# EAGLE design leak (EAGLE 9.6.0)
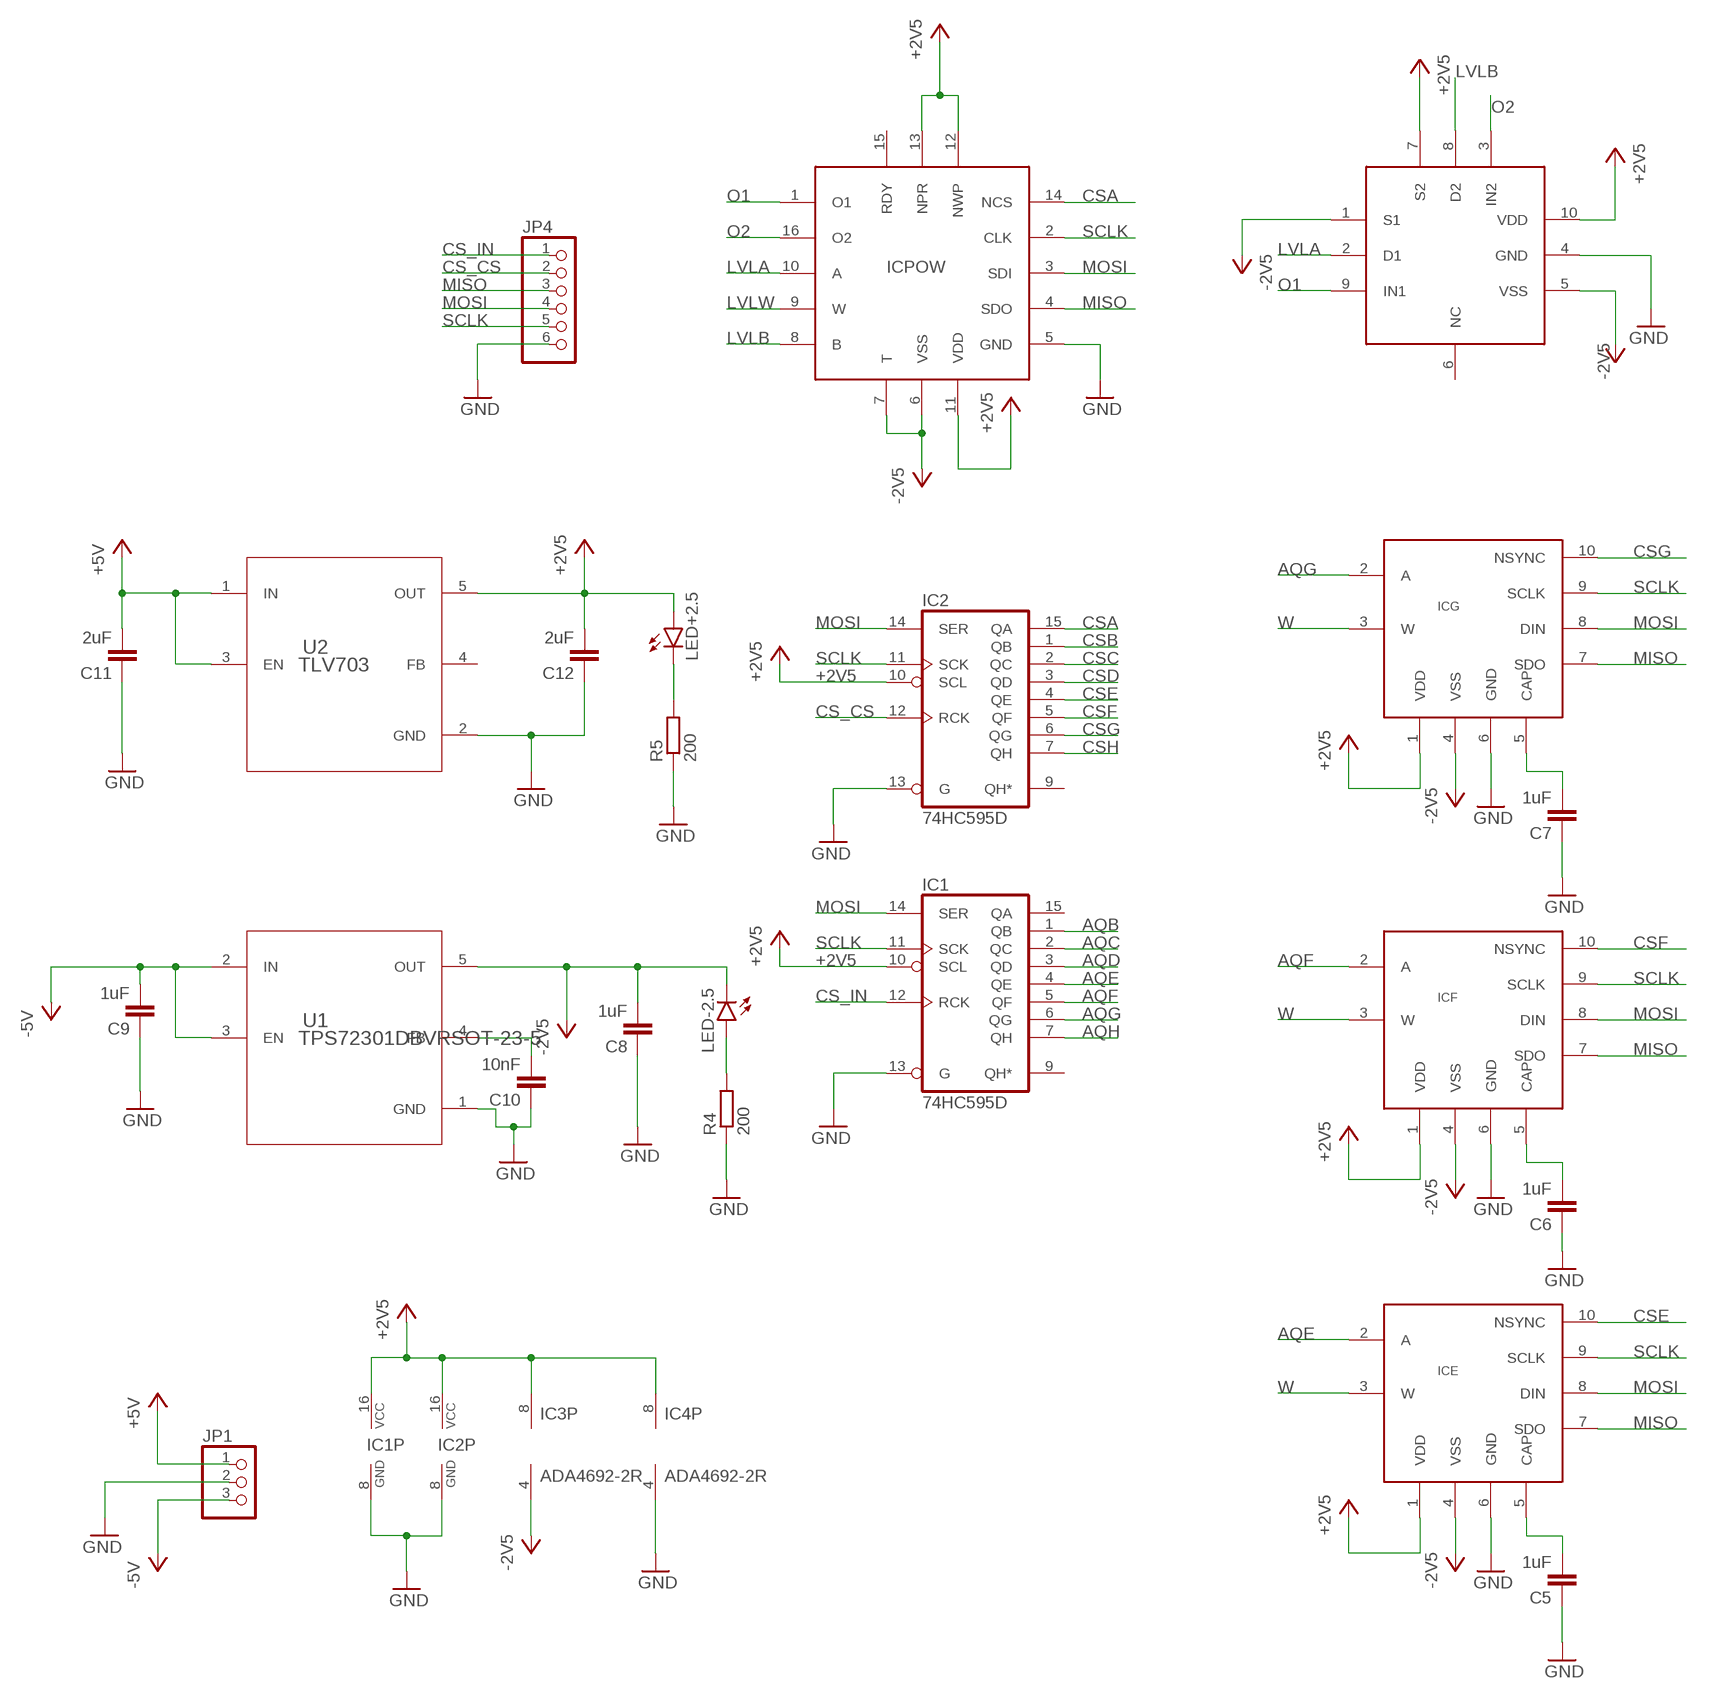
[diagram p0: schematic, sheet 1, part 1 of 2]
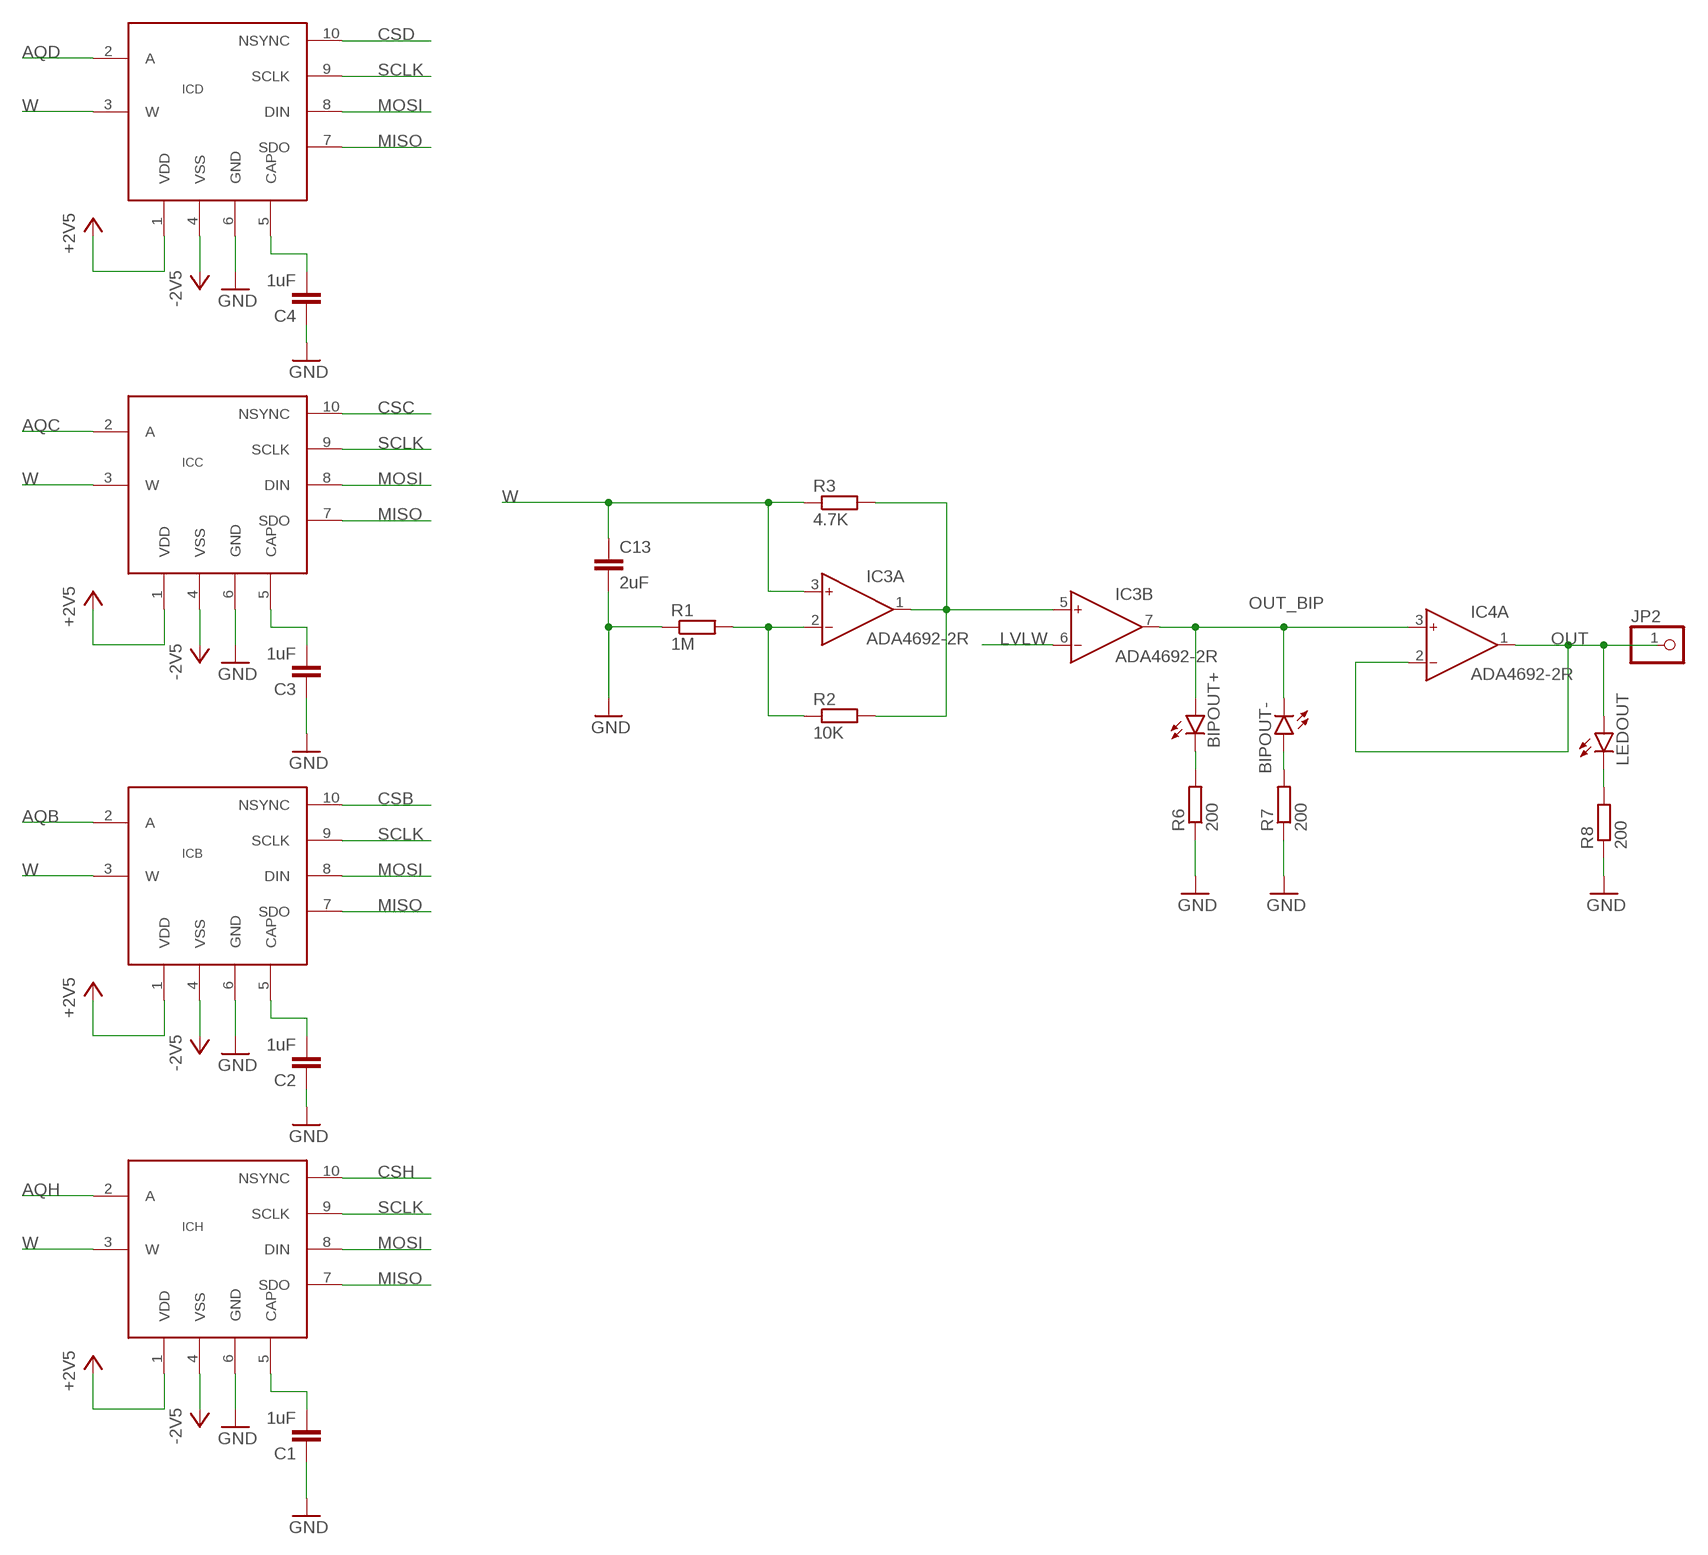
[diagram p1: schematic, sheet 1, part 2 of 2]

## Parts
BIPOUT+  LEDCHIPLED_0805  [CHIPLED_0805]
BIPOUT-  LEDCHIPLED_0805  [CHIPLED_0805]
C1  1uF  C-EUC0603  [C0603]
C2  1uF  C-EUC0603  [C0603]
C3  1uF  C-EUC0603  [C0603]
C4  1uF  C-EUC0603  [C0603]
C5  1uF  C-EUC0603  [C0603]
C6  1uF  C-EUC0603  [C0603]
C7  1uF  C-EUC0603  [C0603]
C8  1uF  C-EUC0603  [C0603]
C9  1uF  C-EUC0603  [C0603]
C10  10nF  C-EUC0603  [C0603]
C11  2uF  C-EUC0603  [C0603]
C12  2uF  C-EUC0603  [C0603]
C13  2uF  C-EUC0805K  [C0805K]
IC1  74HC595D  [SO16]
IC2  74HC595D  [SO16]
IC3  ADA4692-2R  [SO8]
IC4  ADA4692-2R  [SO8]
ICB  AD5270MSOP10  [MSOP10]
ICC  AD5270MSOP10  [MSOP10]
ICD  AD5270MSOP10  [MSOP10]
ICE  AD5270MSOP10  [MSOP10]
ICF  AD5270MSOP10  [MSOP10]
ICG  AD5270MSOP10  [MSOP10]
ICH  AD5270MSOP10  [MSOP10]
ICPOW  AD5231  [TSSOP16]
ICSW  ADG621  [MSOP10]
JP1  PINHD-1X3  [1X03]
JP2  PINHD-1X1  [1X01]
JP4  PINHD-1X6  [1X06]
LED+2.5  LEDCHIPLED_0805  [CHIPLED_0805]
LED-2.5  LEDCHIPLED_0805  [CHIPLED_0805]
LEDOUT  LEDCHIPLED_0805  [CHIPLED_0805]
R1  1M  R-EU_R0805  [R0805]
R2  10K  R-EU_R0805  [R0805]
R3  4.7K  R-EU_R0805  [R0805]
R4  200  R-EU_R0603  [R0603]
R5  200  R-EU_R0603  [R0603]
R6  200  R-EU_R0603  [R0603]
R7  200  R-EU_R0603  [R0603]
R8  200  R-EU_R0603  [R0603]
U1  TPS72301DBVRSOT-23-5  [SOT95P280X145-5N]
U2  TLV703  [SOT95P280X145-5N]

## Nets
+2V5: C12.2 IC1.10(SCL) IC1.16(VCC) IC2.10(SCL) IC2.16(VCC) IC3.8(P:V+) IC4.8(P:V+) ICB.1(VDD) ICC.1(VDD) ICD.1(VDD) ICE.1(VDD) ICF.1(VDD) ICG.1(VDD) ICH.1(VDD) ICPOW.11(VDD) ICPOW.12(NWP) ICPOW.13(NPR) ICSW.7(S2) ICSW.10(VDD) LED+2.5.A U2.5(OUT)
+5V: C11.2 JP1.1 U2.1(IN) U2.3(EN)
-2V5: C8.2 IC3.4(P:V-) ICB.4(VSS) ICC.4(VSS) ICD.4(VSS) ICE.4(VSS) ICF.4(VSS) ICG.4(VSS) ICH.4(VSS) ICPOW.6(VSS) ICPOW.7(T) ICSW.1(S1) ICSW.5(VSS) LED-2.5.C U1.5(OUT)
-5V: C9.2 JP1.3 U1.2(IN) U1.3(EN)
AQB: IC1.1(QB) ICB.2(A)
AQC: IC1.2(QC) ICC.2(A)
AQD: IC1.3(QD) ICD.2(A)
AQE: IC1.4(QE) ICE.2(A)
AQF: IC1.5(QF) ICF.2(A)
AQG: IC1.6(QG) ICG.2(A)
AQH: IC1.7(QH) ICH.2(A)
CS_CS: IC2.12(RCK) JP4.2
CS_IN: IC1.12(RCK) JP4.1
CSA: IC2.15(QA) ICPOW.14(NCS)
CSB: IC2.1(QB) ICB.10(NSYNC)
CSC: IC2.2(QC) ICC.10(NSYNC)
CSD: IC2.3(QD) ICD.10(NSYNC)
CSE: IC2.4(QE) ICE.10(NSYNC)
CSF: IC2.5(QF) ICF.10(NSYNC)
CSG: IC2.6(QG) ICG.10(NSYNC)
CSH: IC2.7(QH) ICH.10(NSYNC)
GND: C1.1 C2.1 C3.1 C4.1 C5.1 C6.1 C7.1 C8.1 C9.1 C10.1 C11.1 C12.1 C13.2 IC1.8(GND) IC1.13(G) IC2.8(GND) IC2.13(G) IC4.4(P:V-) ICB.6(GND) ICC.6(GND) ICD.6(GND) ICE.6(GND) ICF.6(GND) ICG.6(GND) ICH.6(GND) ICPOW.5(GND) ICSW.4(GND) JP1.2 JP4.6 R1.1 R4.1 R5.1 R6.1 R7.1 R8.1 U1.1(GND) U2.2(GND)
LVLA: ICPOW.10(A) ICSW.2(D1)
LVLB: ICPOW.8(B) ICSW.8(D2)
LVLW: IC3.6(B:IN-) ICPOW.9(W)
MISO: ICB.7(SDO) ICC.7(SDO) ICD.7(SDO) ICE.7(SDO) ICF.7(SDO) ICG.7(SDO) ICH.7(SDO) ICPOW.4(SDO) JP4.3
MOSI: IC1.14(SER) IC2.14(SER) ICB.8(DIN) ICC.8(DIN) ICD.8(DIN) ICE.8(DIN) ICF.8(DIN) ICG.8(DIN) ICH.8(DIN) ICPOW.3(SDI) JP4.4
N$1: C10.2 U1.4(FB)
N$2: IC3.1(A:OUT) IC3.5(B:IN+) R2.2 R3.2
N$3: C2.2 ICB.5(CAP)
N$4: LED-2.5.A R4.2
N$5: C1.2 ICH.5(CAP)
N$6: IC3.2(A:IN-) R1.2 R2.1
N$7: LED+2.5.C R5.2
N$8: C3.2 ICC.5(CAP)
N$9: BIPOUT+.C R6.2
N$10: BIPOUT-.A R7.2
N$11: C4.2 ICD.5(CAP)
N$12: LEDOUT.C R8.2
N$14: C5.2 ICE.5(CAP)
N$17: C6.2 ICF.5(CAP)
N$20: C7.2 ICG.5(CAP)
O1: ICPOW.1(O1) ICSW.9(IN1)
O2: ICPOW.16(O2) ICSW.3(IN2)
OUT: IC4.1(A:OUT) IC4.2(A:IN-) JP2.1 LEDOUT.A
OUT_BIP: BIPOUT+.A BIPOUT-.C IC3.7(B:OUT) IC4.3(A:IN+)
SCLK: IC1.11(SCK) IC2.11(SCK) ICB.9(SCLK) ICC.9(SCLK) ICD.9(SCLK) ICE.9(SCLK) ICF.9(SCLK) ICG.9(SCLK) ICH.9(SCLK) ICPOW.2(CLK) JP4.5
W: C13.1 IC3.3(A:IN+) ICB.3(W) ICC.3(W) ICD.3(W) ICE.3(W) ICF.3(W) ICG.3(W) ICH.3(W) R3.1
Unconnected: IC1.9(QH*) IC1.15(QA) IC2.9(QH*) IC4.5(B:IN+) IC4.6(B:IN-) IC4.7(B:OUT) ICPOW.15(RDY) ICSW.6(NC) U2.4(FB)

## Library data of the parts
BIPOUT+ BIPOUT- LED+2.5 LED-2.5 LEDOUT = led:LED: LED OSRAM: - CHIPLED LG R971, LG N971, LY N971, LG Q971, LY Q971, LO R971, LY R971 LH N974, LH R974 LS Q976, LO Q976, LY Q976 LO Q996 - Hyper CHIPLED LW Q18S LB Q993, LB Q99A, LB R99A - SideLED LS A670, LO A670, LY A670, LG A670, LP A670 LB A673, LV A673, LT A673, LW A673 LH A674 LY A675 LS A676, LA A676, LO A676, LY A676, LW A676 LS A679, LY A679, LG A679 - Hyper Micro SIDELED® LS Y876, LA Y876, LO Y876, LY Y876 LT Y87S - SmartLED LW L88C, LW L88S LB L89C, LB L89S, LG L890 LS L89K, LO L89K, LY L89K LS L896, LA L896, LO L896, LY L896 - TOPLED LS T670, LO T670, LY T670, LG T670, LP T670 LSG T670, LSP T670, LSY T670, LOP T670, LYG T670 LG T671, LOG T671, LSG T671 LB T673, LV T673, LT T673, LW T673 LH T674 LS T676, LA T676, LO T676, LY T676, LB T676, LH T676, LSB T676, LW T676 LB T67C, LV T67C, LT T67C, LS T67K, LO T67K, LY T67K, LW E67C LS E67B, LA E67B, LO E67B, LY E67B, LB E67C, LV E67C, LT E67C LW T67C LS T679, LY T679, LG T679 LS T770, LO T770, LY T770, LG T770, LP T770 LB T773, LV T773, LT T773, LW T773 LH T774 LS E675, LA E675, LY E675, LS T675 LS T776, LA T776, LO T776, LY T776, LB T776 LHGB T686 LT T68C, LB T68C - Hyper Mini TOPLED® LB M676 - Mini TOPLED Santana® LG M470 LS M47K, LO M47K, LY M47K Source: http://www.osram.convergy.de LUXEON: - LUMILED® LXK2-PW12-R00, LXK2-PW12-S00, LXK2-PW14-U00, LXK2-PW14-V00 LXK2-PM12-R00, LXK2-PM12-S00, LXK2-PM14-U00 LXK2-PE12-Q00, LXK2-PE12-R00, LXK2-PE12-S00, LXK2-PE14-T00, LXK2-PE14-U00 LXK2-PB12-K00, LXK2-PB12-L00, LXK2-PB12-M00, LXK2-PB14-N00, LXK2-PB14-P00, LXK2-PB14-Q00 LXK2-PR12-L00, LXK2-PR12-M00, LXK2-PR14-Q00, LXK2-PR14-R00 LXK2-PD12-Q00, LXK2-PD12-R00, LXK2-PD12-S00 LXK2-PH12-R00, LXK2-PH12-S00 LXK2-PL12-P00, LXK2-PL12-Q00, LXK2-PL12-R00 Source: www.luxeon.com KINGBRIGHT: KA-3528ASYC Source: www.kingbright.com
C1-C13 = rcl:C-EU: CAPACITOR, European symbol; SPICEPREFIX: C
IC1 IC2 = 74xx-eu:74*595: 8-bit SHIFT REGISTER, output latch
IC3 IC4 = analog-devices:ADA4692-2: Low Power, 3.6 MHz, Low Noise, Rail-to-Rail Output, Operational Amplifiers Source: http://www.analog.com/static/imported-files/data_sheets/ADA4691-2_4692-2_4692-4.pdf; MPN: ADA4692-2ARZ; OC_FARNELL: 1760810; OC_NEWARK: 05R6523
ICB ICC ICD ICE ICF ICG ICH = untitled:AD5270
ICPOW = untitled:AD5231
ICSW = untitled:ADG621
JP1 = pinhead:PINHD-1X3: PIN HEADER
JP2 = pinhead:PINHD-1X1: PIN HEADER
JP4 = pinhead:PINHD-1X6: PIN HEADER
R1-R8 = rcl:R-EU_: RESISTOR, European symbol; SPICEPREFIX: R
U1 = titled:TPS72301DBVR
U2 = titled:TLV703

## Net classes
0 default: width 0.15 mm, drill 0.3 mm, clearance 0.004 mm

## Board
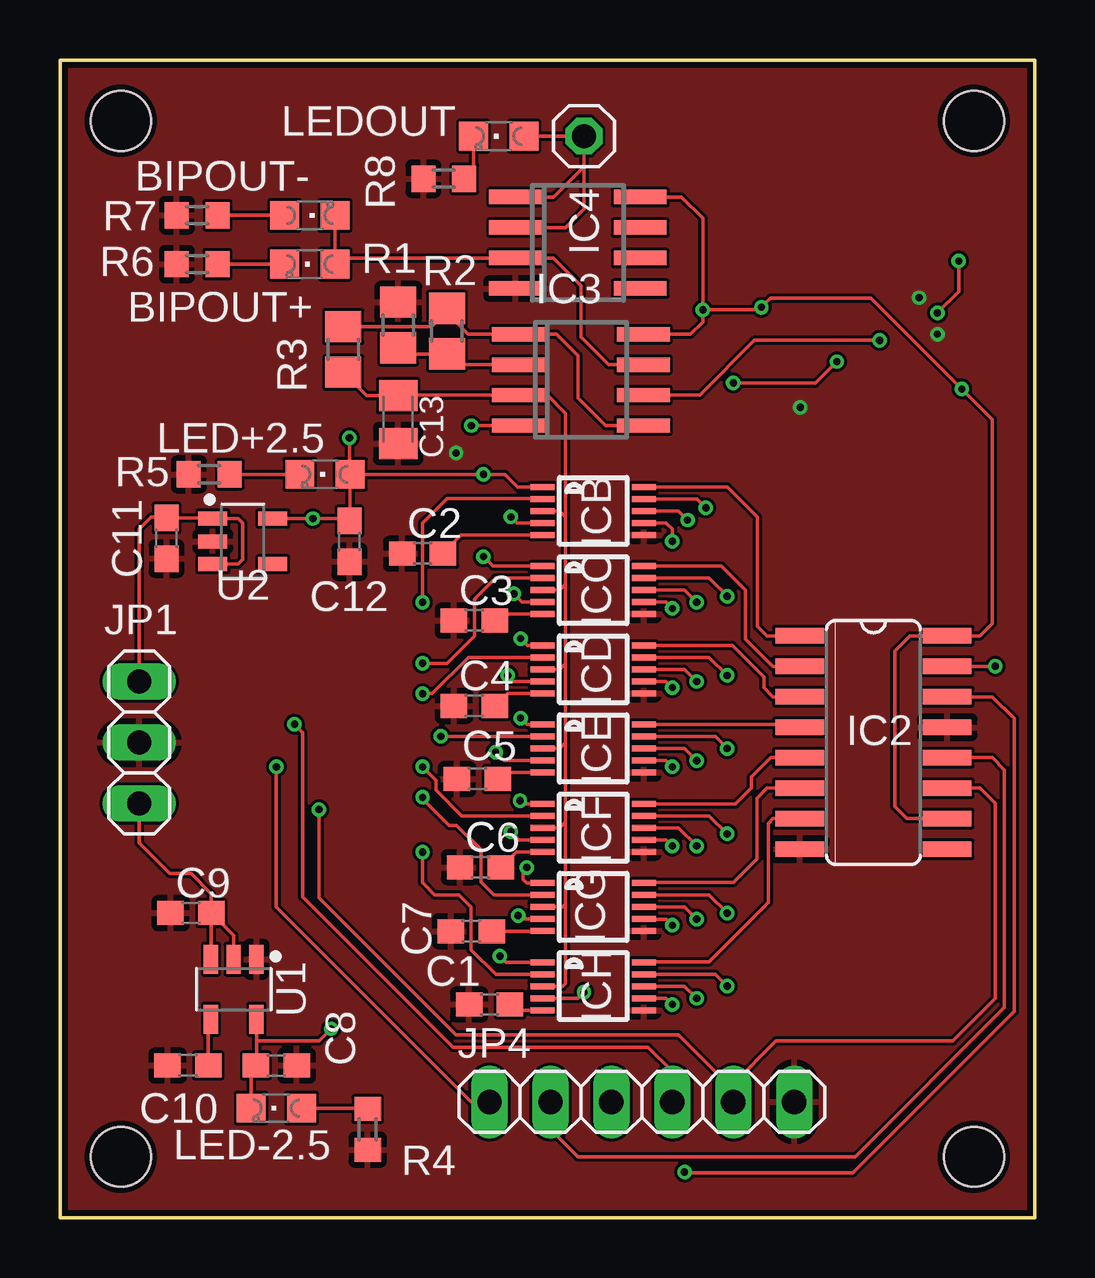
[diagram p2: board, top side]
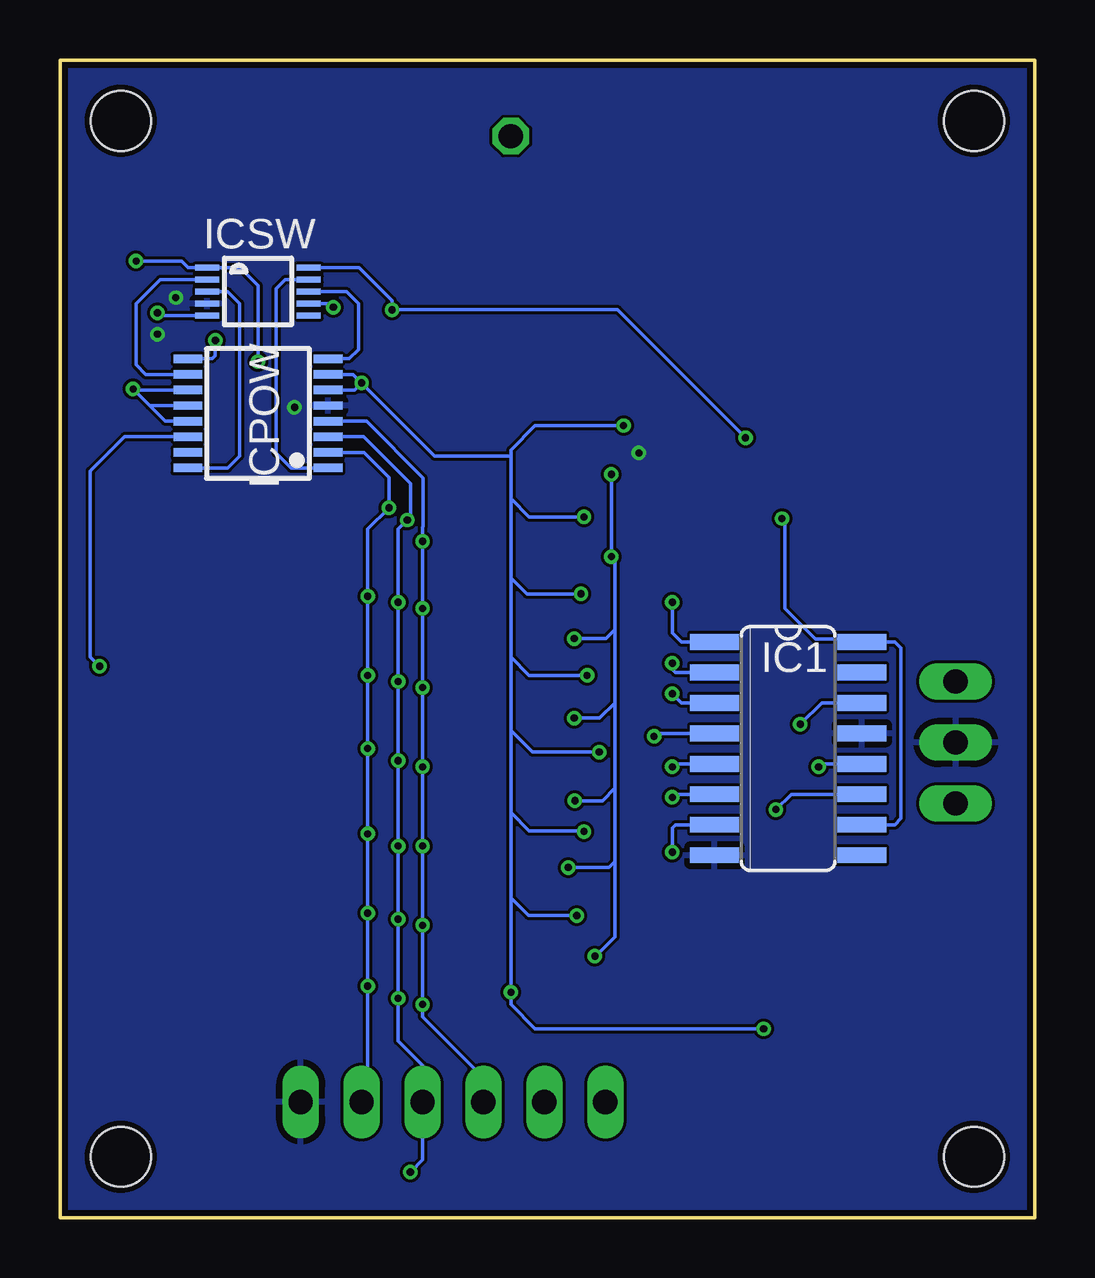
[diagram p3: board, bottom side, seen from below]

Size 40.64 x 48.26 mm. Coordinates in mm from the lower left corner, seen from the top.
Outline: 0,48.26 0,0 40.64,0 40.64,48.26 0,48.26
Copper layers (1*16): Top 0.018mm / dielectric 1.5mm / Bottom 0.018mm
Design rules "resonit2layer_normal": minimum track width 0.125mm, minimum drill 0.3mm, track to track 0.125mm, track to pad 0.125mm, pad to pad 0.125mm, via to via 0.2mm, smd to smd 0.125mm, copper to edge 0.25mm, drill to drill 0.25mm, minimum pad ring 10mil, minimum via ring 0.15mm, stop-mask expansion 4mil, vias tented up to drill 0mil, thermal gap 10mil
Holes 2.5 mm at 2.54,2.54 38.1,2.54 38.1,45.72 2.54,45.72

### Footprints (pad centres in the part's own frame; a part is rotated, then mirrored left to right if it is on the bottom)
CHIPLED_0805 = smd 1.2 x 1.2: A 0,-1.05; C 0,1.05
C0603 = smd 1.1 x 1: 1 -0.85,0; 2 0.85,0
C0805K = smd 1.3 x 1.6: 1 -1,0; 2 1,0
SO16 = smd 0.66 x 2.032: 1 -4.445,-3.073; 2 -3.175,-3.073; 3 -1.905,-3.073; 4 -0.635,-3.073; 5 0.635,-3.073; 6 1.905,-3.073; 7 3.175,-3.073; 8 4.445,-3.073; 9 4.445,3.073; 10 3.175,3.073; 11 1.905,3.073; 12 0.635,3.073; 13 -0.635,3.073; 14 -1.905,3.073; 15 -3.175,3.073; 16 -4.445,3.073
SO8 = smd 0.6 x 2.2: 1 -1.905,-2.6; 2 -0.635,-2.6; 3 0.635,-2.6; 4 1.905,-2.6; 5 1.905,2.6; 6 0.635,2.6; 7 -0.635,2.6; 8 -1.905,2.6
MSOP10 = smd 0.25 x 1: 1 -1,-2.113; 2 -0.5,-2.113; 3 0,-2.113; 4 0.5,-2.113; 5 1,-2.113; 6 1,2.113; 7 0.5,2.113; 8 0,2.113; 9 -0.5,2.113; 10 -1,2.113
TSSOP16 = smd 0.35 x 1.2: 1 -2.275,-2.925; 2 -1.625,-2.925; 3 -0.975,-2.925; 4 -0.325,-2.925; 5 0.325,-2.925; 6 0.975,-2.925; 7 1.625,-2.925; 8 2.275,-2.925; 9 2.275,2.925; 10 1.625,2.925; 11 0.975,2.925; 12 0.325,2.925; 13 -0.325,2.925; 14 -0.975,2.925; 15 -1.625,2.925; 16 -2.275,2.925
1X03 = drill 1.016 long: 1 -2.54,0; 2 0,0; 3 2.54,0
1X01 = drill 1.016 octagon: 1 0,0
1X06 = drill 1.016 long: 1 -6.35,0; 2 -3.81,0; 3 -1.27,0; 4 1.27,0; 5 3.81,0; 6 6.35,0
R0805 = smd 1.3 x 1.5: 1 -0.95,0; 2 0.95,0
R0603 = smd 1 x 1.1: 1 -0.85,0; 2 0.85,0
SOT95P280X145-5N = smd 1.209 x 0.589: 1 -1.253,0.95; 2 -1.253,0; 3 -1.253,-0.95; 4 1.253,-0.95; 5 1.253,0.95

### Placement (x,y rotation side)
BIPOUT+  10.41,39.75 90 top
BIPOUT-  10.41,41.78 270 top
C1  17.91,8.89 0 top
C2  15.11,27.69 0 top
C3  17.27,24.89 0 top
C4  17.27,21.34 0 top
C5  17.4,18.29 0 top
C6  17.53,14.61 0 top
C7  17.14,11.94 0 top
C8  9.02,6.35 180 top
C9  5.46,12.7 0 top
C10  5.33,6.35 0 top
C11  4.45,28.32 90 top
C12  12.06,28.19 90 top
C13  14.1,33.27 270 top
IC1  10.29,19.56 270 bottom
IC2  33.91,19.81 270 top
IC3  21.72,34.92 270 top
IC4  21.59,40.64 270 top
ICB  22.23,29.46 270 top
ICC  22.23,26.16 270 top
ICD  22.23,22.86 270 top
ICE  22.23,19.56 270 top
ICF  22.23,16.26 270 top
ICG  22.23,12.95 270 top
ICH  22.23,9.65 270 top
ICPOW  32.38,33.53 90 bottom
ICSW  32.38,38.61 270 bottom
JP1  3.3,19.81 270 top
JP2  21.84,45.09 0 top
JP4  24.26,4.83 0 top
LED+2.5  11.05,30.99 90 top
LED-2.5  9.02,4.57 90 top
LEDOUT  18.29,45.09 90 top
R1  14.1,37.21 270 top
R2  16.13,36.96 90 top
R3  11.81,36.2 90 top
R4  12.83,3.68 90 top
R5  6.22,30.99 0 top
R6  5.71,39.75 0 top
R7  5.71,41.78 0 top
R8  16,43.31 0 top
U1  7.24,9.53 270 top
U2  7.62,28.19 0 top

### Tracks (layer width: path | path; a pad name or v marks a point on that pad's centre or on a via)
+2V5  (via drill 0.3)
  Top 0.152: v26.8,37.85 29.14,37.85 v29.24,37.95 29.62,38.33 33.8,38.33 v37.59,34.54 38.86,33.27 38.86,24.77 38.35,24.26 IC2.16 35.43,24.26 34.8,23.62 34.8,17.14 35.31,16.64 IC2.10 | IC4.8 25.91,42.55 26.8,41.66 v26.8,37.85 | IC3.8 26.29,36.83 26.8,37.34 v26.8,37.85 | ICC.1 18.05,27.16 v17.65,27.56 | LED+2.5.A v17.65,30.99 18.54,30.99 19.07,30.46 ICB.1 | ICH.1 18.6,10.65 v18.34,10.91 | ICD.1 19.48,23.86 v19.2,24.14 | ICE.1 19.47,20.56 v19.2,20.83 | ICF.1 19.3,17.26 v19.18,17.38 | ICG.1 19.45,13.95 19.3,14.1 19.3,14.45 v19.46,14.6 | U2.5 v10.54,29.14 11.96,29.14 C12.2 12.1,29.08 LED+2.5.A | LED+2.5.A 12.06,31.02 v12.06,32.51
  Bottom 0.152: IC1.10 5.84,16.38 5.59,16.64 5.59,23.75 5.84,24 IC1.16 7.34,24.13 9.14,24.13 10.41,25.4 10.41,29.02 v10.54,29.14 | v29.24,37.95 29.4,38.11 ICSW.7 | ICSW.10 28.18,39.61 26.8,38.23 v26.8,37.85 17.4,37.85 v12.06,32.51 | v37.59,34.54 37.55,34.5 | 37.55,34.5 ICPOW.11 | ICPOW.12 36.9,33.85 | 36.9,33.85 37.55,34.5 | ICPOW.13 36.25,33.2 36.9,33.85 | v17.65,30.99 v17.65,27.56 17.5,27.41 17.5,24.51 | 17.5,24.51 17.5,21.46 | 17.5,21.46 17.5,17.91 | 17.5,17.91 17.5,14.86 | 17.5,14.86 17.5,11.71 18.3,10.91 v18.34,10.91 | v19.46,14.6 17.76,14.6 17.5,14.86 | v19.2,24.14 17.87,24.14 17.5,24.51 | v19.2,20.83 18.14,20.83 17.5,21.46 | v19.18,17.38 18.03,17.38 17.5,17.91
+5V
  Top 0.152: JP1.1 3.3,28.7 3.81,29.21 4.41,29.21 C11.2 6.34,29.17 U2.1 7.43,29.14 7.62,28.96 7.62,27.43 7.43,27.24 U2.3
-2V5  (via drill 0.3)
  Top 0.152: 8.19,7.37 8.19,6.37 C8.2 7.97,6.15 LED-2.5.C | 8.19,7.37 U1.5 | ICF.4 19.14,15.76 v18.8,16.1 | ICE.4 18.51,19.06 v18.16,19.41 | ICH.4 21.6,9.15 v21.84,9.4 | v11.3,7.87 10.79,7.37 8.19,7.37 | ICG.4 19.24,12.45 v19.1,12.59 | ICD.4 18.91,22.36 v18.67,22.61 | ICC.4 19.27,25.66 v18.92,26.01 | v18.8,29.21 19.04,28.96 ICB.4 | IC3.4 v17.14,33.02 | v28.07,34.8 31.5,34.8 v32.38,35.69 | v36.58,37.72 37.47,38.61 v37.47,39.88
  Bottom 0.152: 21.84,13.34 v21.84,9.4 21.84,8.89 20.83,7.87 v11.3,7.87 | 21.84,13.34 21.84,16.89 | 21.84,16.89 21.84,20.32 | 21.84,20.32 21.84,23.37 | 21.84,23.37 21.84,26.67 | 21.84,26.67 21.84,29.97 | 21.84,29.97 21.84,31.75 | 21.84,31.75 21.84,32 20.83,33.02 v17.14,33.02 | v19.1,12.59 21.1,12.59 21.84,13.34 | v18.8,16.1 18.82,16.13 21.08,16.13 21.84,16.89 | v18.16,19.41 20.93,19.41 21.84,20.32 | v18.67,22.61 21.08,22.61 21.84,23.37 | v18.92,26.01 21.18,26.01 21.84,26.67 | 21.84,29.97 21.08,29.21 v18.8,29.21 | 21.84,31.75 25.02,31.75 v28.07,34.8 | v32.38,35.69 32.38,38.86 33.13,39.61 ICSW.1 35.29,39.61 35.56,39.88 v37.47,39.88 | ICSW.5 36.47,37.61 v36.58,37.72 | ICPOW.7 28.42,35.15 v28.07,34.8 | ICPOW.6 28.36,34.5 v28.07,34.8
-5V
  Top 0.152: C9.2 6.31,10.8 U1.3 | C9.2 7.24,11.77 U1.2 | JP1.3 3.3,15.62 4.57,14.35 5.46,14.35 6.31,13.5 C9.2
AQB  (via drill 0.3)
  Top 0.152: v15.11,25.65 15.11,28.96 16.13,29.97 20.1,29.97 ICB.2
  Bottom 0.152: IC1.1 14.73,24 15.11,24.38 v15.11,25.65
AQC  (via drill 0.3)
  Top 0.152: ICC.2 18.15,26.66 17.27,25.78 17.27,24.26 16.13,23.11 v15.11,23.11
  Bottom 0.152: IC1.2 14.99,22.73 15.11,22.86 v15.11,23.11
AQD  (via drill 0.3)
  Top 0.152: v15.11,21.84 15.51,21.84 17.03,23.36 ICD.2
  Bottom 0.152: IC1.3 14.73,21.46 v15.11,21.84
AQE  (via drill 0.3)
  Top 0.152: v15.88,20.07 ICE.2
  Bottom 0.152: IC1.4 15.75,20.19 v15.88,20.07
AQF  (via drill 0.3)
  Top 0.152: v15.11,18.8 15.67,18.24 15.67,17.83 16.75,16.76 ICF.2
  Bottom 0.152: IC1.5 14.99,18.92 v15.11,18.8
AQG  (via drill 0.3)
  Top 0.152: v15.11,17.53 15.11,17.46 16.22,16.35 16.54,16.35 17.55,15.34 17.55,13.99 18.09,13.45 ICG.2
  Bottom 0.152: IC1.6 14.99,17.65 v15.11,17.53
AQH  (via drill 0.3)
  Top 0.152: v15.11,15.24 15.11,13.97 15.62,13.46 16.64,13.46 17.14,12.95 17.14,11.18 18.17,10.15 ICH.2
  Bottom 0.152: IC1.7 14.99,16.38 15.11,16.26 v15.11,15.24
CS_CS
  Top 0.152: JP4.2 20.45,3.68 21.59,2.54 33.15,2.54 39.37,8.76 39.37,18.67 38.86,19.18 IC2.12
CS_IN  (via drill 0.3)
  Top 0.152: JP4.1 17.14,4.83 9.02,12.95 v9.02,18.8
  Bottom 0.152: IC1.12 8.89,18.92 v9.02,18.8
CSA  (via drill 0.3)
  Top 0.152: v38.99,22.99 IC2.15
  Bottom 0.152: ICPOW.14 37.93,32.55 39.37,31.11 39.37,23.37 v38.99,22.99
CSB
  Top 0.152: IC2.1 29.46,24.26 29.08,24.64 29.08,29.21 27.83,30.46 ICB.10
CSC
  Top 0.152: ICC.10 27.57,27.16 28.57,26.16 28.57,24.13 29.72,22.99 IC2.2
CSD
  Top 0.152: ICD.10 28.02,23.86 29.34,22.55 29.34,22.1 29.72,21.72 IC2.3
CSE
  Top 0.152: ICE.10 30.73,20.56 IC2.4
CSF
  Top 0.152: IC2.5 29.64,19.18 28.83,18.36 28.83,17.92 28.16,17.26 ICF.10
CSG
  Top 0.152: ICG.10 24.35,13.97 28.07,13.97 29.05,14.95 29.05,17.49 29.46,17.91 IC2.6
CSH
  Top 0.152: ICH.10 24.35,10.67 27.05,10.67 29.53,13.14 29.53,16.45 29.72,16.64 IC2.7
GND  (via drill 0.3)
  other vias: 30.86,33.78 36.58,36.83 16.51,31.88 35.81,38.35
  pour Top: -1.27,-3.81 -1.27,57.15 67.31,57.15 76.2,48.26 76.2,15.24 57.15,-3.81
  pour Bottom: -5.08,1.27 -5.08,48.51 6.1,59.69 71.12,59.69 82.55,48.26 82.55,22.86 58.42,-1.27 -2.54,-1.27
LVLA
  Bottom 0.152: ICSW.2 36.46,39.11 37.47,38.1 37.47,35.56 37.06,35.15 ICPOW.10
LVLB
  Bottom 0.152: ICSW.8 28.7,38.61 28.19,38.1 28.19,36.2 28.59,35.8 ICPOW.8
LVLW  (via drill 0.3)
  Top 0.152: v34.16,36.58 28.96,36.58 26.67,34.29 IC3.6
  Bottom 0.152: ICPOW.9 35.3,35.81 34.29,35.81 34.16,35.94 v34.16,36.58
MISO  (via drill 0.3)
  Top 0.152: v25.53,28.19 25.53,28.7 25.27,28.96 ICB.7 | ICC.7 25.27,25.66 v25.53,25.4 | ICD.7 25.27,22.36 v25.53,22.1 | ICE.7 25.27,19.06 v25.53,18.8 | ICF.7 25.27,15.76 v25.53,15.49 | ICG.7 25.27,12.45 v25.53,12.19 | ICH.7 25.27,9.15 v25.53,8.89
  Bottom 0.152: JP4.3 22.99,5.84 25.53,8.38 v25.53,8.89 v25.53,12.19 v25.53,15.49 v25.53,18.8 v25.53,22.1 v25.53,25.4 v25.53,28.19 25.53,28.79 25.51,28.81 25.51,30.84 27.87,33.2 ICPOW.4
MOSI  (via drill 0.3)
  Top 0.152: v26.16,29.08 25.78,29.46 ICB.8 | ICC.8 26.04,26.16 v26.54,25.65 | ICD.8 26.04,22.86 v26.54,22.35 | ICE.8 26.04,19.56 v26.54,19.05 | ICF.8 25.78,16.26 v26.54,15.49 | ICG.8 26.04,12.95 v26.54,12.45 | ICH.8 26.04,9.65 v26.54,9.14 | IC2.14 38.86,21.72 39.77,20.81 39.77,8.6 33.06,1.88 26.06,1.88 v26.04,1.91 | v9.78,20.57 10.12,20.23 10.12,13.37 16.38,7.11 24.51,7.11 25.53,6.1 JP4.4
  Bottom 0.152: v26.04,1.91 25.53,2.41 JP4.4 25.53,6.35 26.54,7.37 v26.54,9.14 v26.54,12.45 v26.54,15.49 v26.54,19.05 v26.54,22.35 v26.54,25.65 26.54,28.7 v26.16,29.08 26.04,29.21 26.04,30.61 27.98,32.55 ICPOW.3 | IC1.14 8.89,21.46 v9.78,20.57
N$1
  Top 0.152: U1.4 6.18,8.17 C10.2
N$2
  Top 0.152: IC3.5 22.73,33.02 21.59,34.16 21.59,35.94 20.7,36.83 IC3.1 17.02,36.83 16.1,37.75 | R3.2 15.49,37.15 16.1,37.75 | R2.2 16.04,37.81 16.1,37.75
N$3
  Top 0.152: ICB.5 20.1,28.45 16.73,28.45 C2.2
N$4
  Top 0.152: LED-2.5.A 12.79,4.57 R4.2
N$5
  Top 0.152: ICH.5 19,8.65 C1.2
N$6
  Top 0.152: R1.2 14.35,36.01 R2.1 16.58,35.56 IC3.2
N$7
  Top 0.152: LED+2.5.C R5.2
N$8
  Top 0.152: C3.2 18.39,25.16 ICC.5
N$9
  Top 0.152: R6.2 BIPOUT+.C
N$10
  Top 0.152: R7.2 BIPOUT-.A
N$11
  Top 0.152: C4.2 18.65,21.86 ICD.5
N$12
  Top 0.152: LEDOUT.C 17.24,43.69 R8.2
N$14
  Top 0.152: C5.2 18.52,18.56 ICE.5
N$17
  Top 0.152: C6.2 19.03,15.26 ICF.5
N$20
  Top 0.152: ICG.5 20.1,11.94 C7.2
O1
  Bottom 0.152: ICSW.9 31.25,39.11 31.62,38.73 31.62,31.88 31,31.25 ICPOW.1
O2
  Bottom 0.152: ICPOW.16 33.64,31.25 33.15,31.75 33.15,38.1 33.66,38.61 ICSW.3
OUT
  Top 0.152: IC4.1 20.57,42.55 21.84,43.81 | 21.84,43.81 JP2.1 LEDOUT.A | 21.84,43.81 21.84,42.04 21.08,41.27 IC4.2
OUT_BIP
  Top 0.152: IC3.7 22.86,35.56 21.72,36.7 21.72,38.86 20.57,40.01 IC4.3 11.72,40.01 BIPOUT+.A BIPOUT-.C
SCLK  (via drill 0.3)
  Top 0.152: ICB.9 26.55,29.96 v26.92,29.59 | ICC.9 27.06,26.66 v27.81,25.91 | ICD.9 27.06,23.36 v27.81,22.61 | ICE.9 27.31,20.06 v27.81,19.56 | ICF.9 27.06,16.76 v27.81,16 | ICG.9 27.06,13.45 v27.81,12.7 | ICH.9 27.31,10.15 v27.81,9.65 | IC2.11 38.35,17.91 38.99,17.27 38.99,9.14 37.21,7.37 29.84,7.37 28.07,5.59 JP4.5 28.07,5.33 25.78,7.62 16.51,7.62 10.79,13.34 v10.79,17.02
  Bottom 0.152: JP4.5 27.81,5.08 v27.81,9.65 v27.81,12.7 v27.81,16 v27.81,19.56 v27.81,22.61 v27.81,25.91 27.81,28.7 v26.92,29.59 26.92,30.86 27.97,31.9 ICPOW.2 | IC1.11 10.16,17.65 v10.79,17.02
W
  Top 0.152: 21.08,26.42 21.08,29.21 | 21.08,26.42 21.08,23.11 | 21.08,23.11 21.08,19.81 | 21.08,19.81 21.08,16.51 | 21.08,16.51 21.08,13.08 | 21.08,13.08 20.95,12.95 ICG.3 | ICB.3 20.83,29.46 21.08,29.21 | ICC.3 20.83,26.16 21.08,26.42 | ICD.3 20.83,22.86 21.08,23.11 | ICE.3 20.83,19.56 21.08,19.81 | 21.08,13.08 21.08,9.78 20.95,9.65 ICH.3 | 21.08,29.21 21.08,33.53 20.32,34.29 IC3.3 14.11,34.29 C13.1 12.78,34.27 R3.1 | ICF.3 20.83,16.26 21.08,16.51